# EAGLE design Clockv2 (EAGLE 9.6.2)
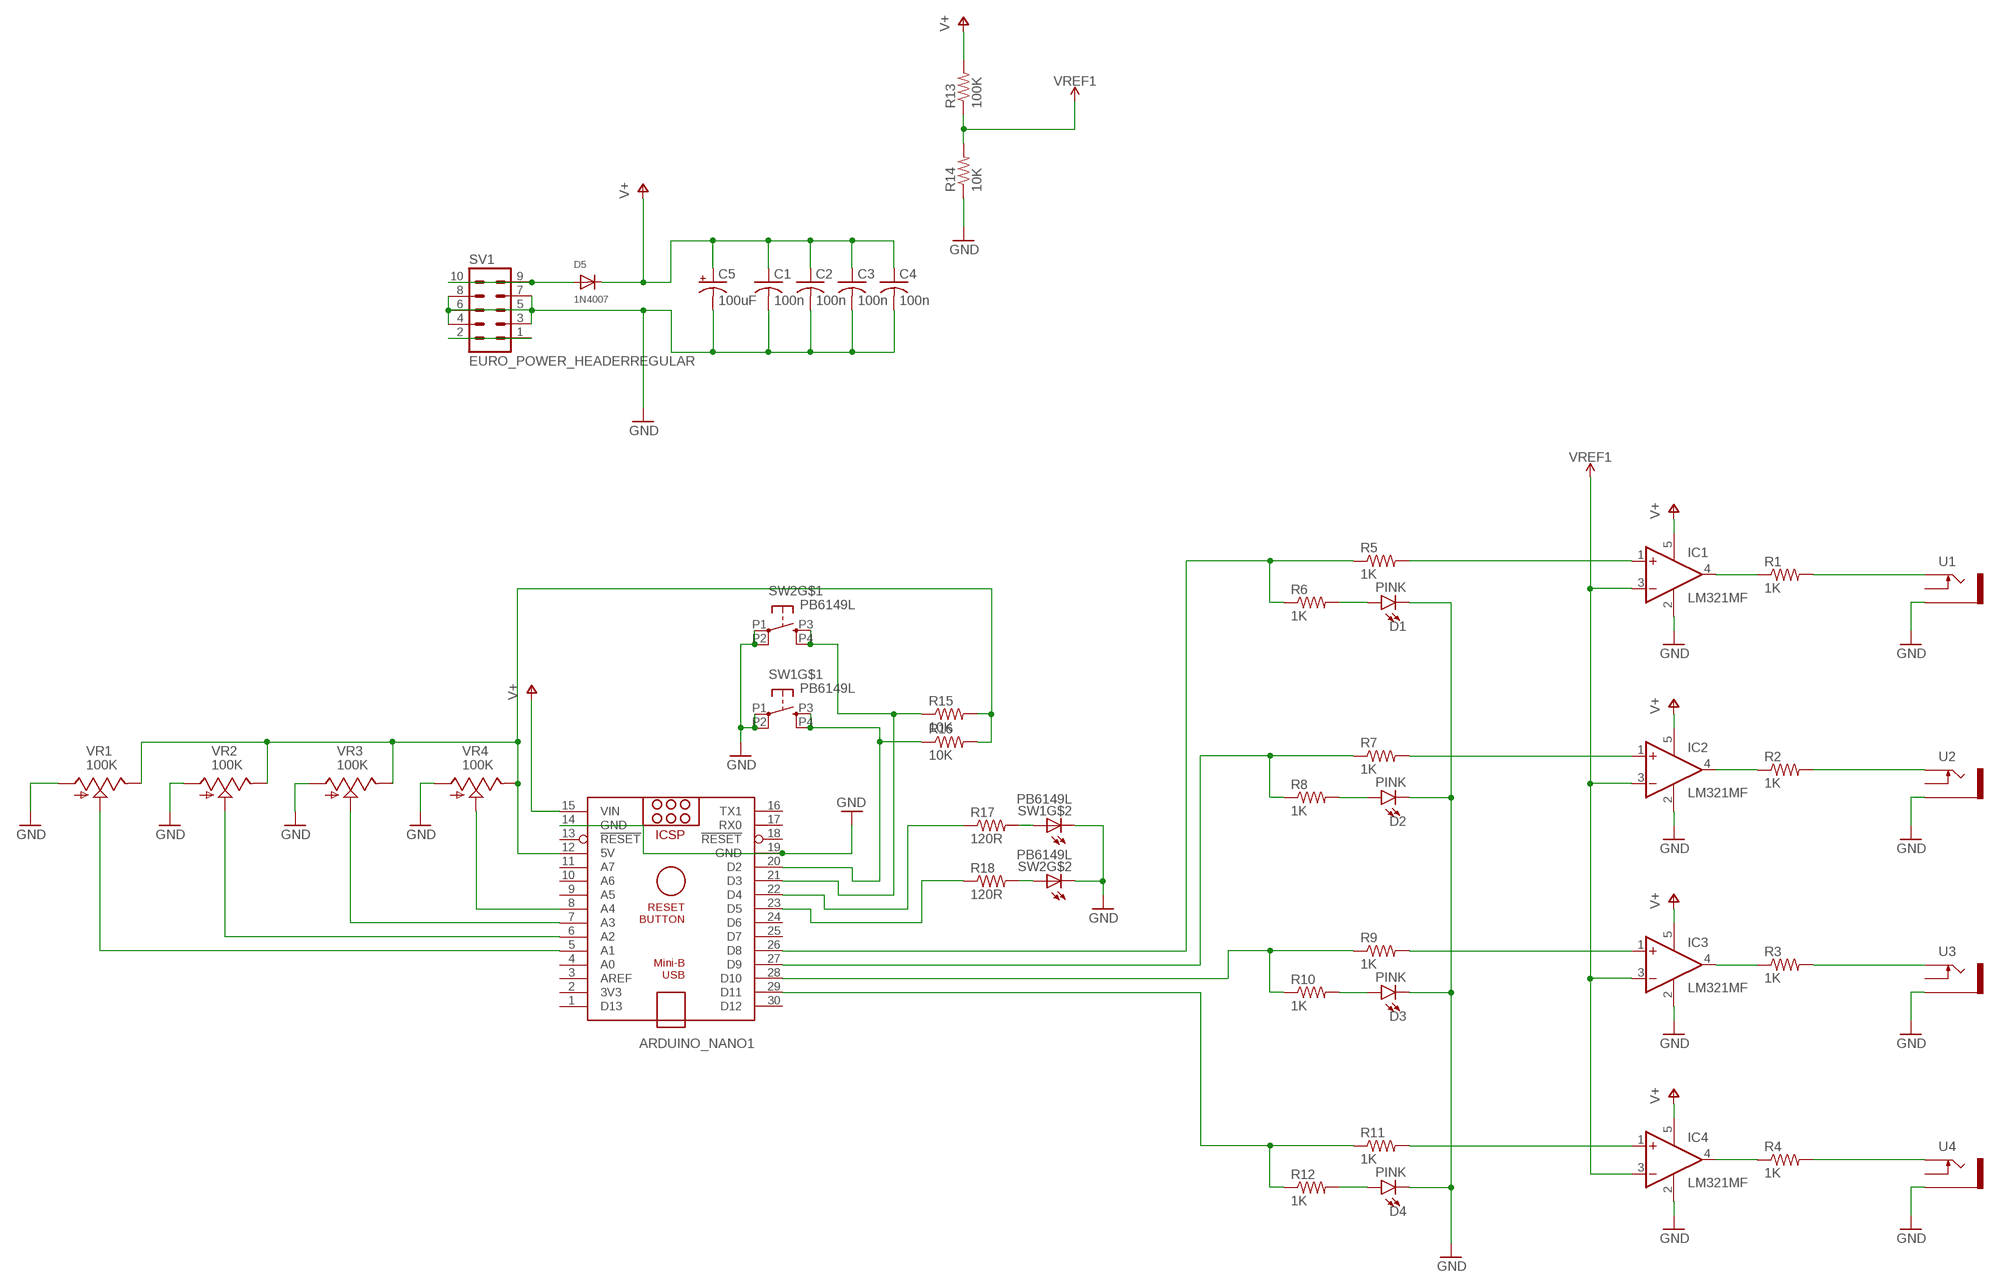
[diagram p0: schematic, sheet 1]

## Parts
ARDUINO_NANO1  ARDUINO_NANO  [ARDUINO_NANO]
C1  100n  C-USC0805K  [C0805K]
C2  100n  C-USC0805K  [C0805K]
C3  100n  C-USC0805K  [C0805K]
C4  100n  C-USC0805K  [C0805K]
C5  100uF  CPOL-USB  [PANASONIC_B]
D1  PINK  LED3MM  [LED_3MM]
D2  PINK  LED3MM  [LED_3MM]
D3  PINK  LED3MM  [LED_3MM]
D4  PINK  LED3MM  [LED_3MM]
D5  1N4007  DIODESOD-123  [SOD-123]
IC1  LM321MF  [SOT23-5]
IC2  LM321MF  [SOT23-5]
IC3  LM321MF  [SOT23-5]
IC4  LM321MF  [SOT23-5]
R1  1K  R-US_R0805  [R0805]
R2  1K  R-US_R0805  [R0805]
R3  1K  R-US_R0805  [R0805]
R4  1K  R-US_R0805  [R0805]
R5  1K  R-US_R0805  [R0805]
R6  1K  R-US_R0805  [R0805]
R7  1K  R-US_R0805  [R0805]
R8  1K  R-US_R0805  [R0805]
R9  1K  R-US_R0805  [R0805]
R10  1K  R-US_R0805  [R0805]
R11  1K  R-US_R0805  [R0805]
R12  1K  R-US_R0805  [R0805]
R13  100K  R-US_R0805  [R0805]
R14  10K  R-US_R0805  [R0805]
R15  10K  R-US_R0805  [R0805]
R16  10K  R-US_R0805  [R0805]
R17  120R  R-US_R0805  [R0805]
R18  120R  R-US_R0805  [R0805]
SV1  EURO_POWER_HEADERREGULAR  [EURO_POWER_HEADER]
SW1  PB6149L  [PB6149L]
SW2  PB6149L  [PB6149L]
U1  THONKICONNNEW  [WQP-PJ301M-12_JACK]
U2  THONKICONNNEW  [WQP-PJ301M-12_JACK]
U3  THONKICONNNEW  [WQP-PJ301M-12_JACK]
U4  THONKICONNNEW  [WQP-PJ301M-12_JACK]
VR1  100K  9MM_SNAP-IN_POT_  [9MM_SNAP-IN_POT]
VR2  100K  9MM_SNAP-IN_POT_  [9MM_SNAP-IN_POT]
VR3  100K  9MM_SNAP-IN_POT_  [9MM_SNAP-IN_POT]
VR4  100K  9MM_SNAP-IN_POT_  [9MM_SNAP-IN_POT]

## Nets
GND: ARDUINO_NANO1.14(GND) ARDUINO_NANO1.19(GND) C1.2 C2.2 C3.2 C4.2 C5.- D1.K(C) D2.K(C) D3.K(C) D4.K(C) IC1.2(V-) IC2.2(V-) IC3.2(V-) IC4.2(V-) R14.1 SV1.3 SV1.4 SV1.5 SV1.6 SV1.7 SV1.8 SW1.L2(C) SW1.P1(P) SW1.P2(P1) SW2.L2(C) SW2.P1(P) SW2.P2(P1) U1.P$3_SLEEVE(SLEEVE) U2.P$3_SLEEVE(SLEEVE) U3.P$3_SLEEVE(SLEEVE) U4.P$3_SLEEVE(SLEEVE) VR1.1(A) VR2.1(A) VR3.1(A) VR4.1(A)
N$1: IC1.4(OUT) R1.1
N$2: IC2.4(OUT) R2.1
N$3: IC3.4(OUT) R3.1
N$4: IC4.4(OUT) R4.1
N$5: R1.2 U1.P$1_TIP(TIP)
N$6: R2.2 U2.P$1_TIP(TIP)
N$7: R3.2 U3.P$1_TIP(TIP)
N$8: R4.2 U4.P$1_TIP(TIP)
N$9: ARDUINO_NANO1.28(D10) R9.1 R10.1
N$10: ARDUINO_NANO1.26(D8) R5.1 R6.1
N$11: ARDUINO_NANO1.27(D9) R7.1 R8.1
N$12: ARDUINO_NANO1.29(D11) R11.1 R12.1
N$13: D1.A R6.2
N$14: ARDUINO_NANO1.12(5V) R15.2 R16.2 VR1.3(E) VR2.3(E) VR3.3(E) VR4.3(E)
N$15: ARDUINO_NANO1.20(D2) R16.1 SW1.P3(S) SW1.P4(S1)
N$16: D2.A R8.2
N$17: ARDUINO_NANO1.21(D3) R15.1 SW2.P3(S) SW2.P4(S1)
N$18: IC2.1(+IN) R7.2
N$19: IC1.1(+IN) R5.2
N$20: IC3.1(+IN) R9.2
N$21: D5.A SV1.9 SV1.10
N$22: D3.A R10.2
N$23: ARDUINO_NANO1.8(A4) VR4.2(S)
N$24: IC4.1(+IN) R11.2
N$25: D4.A R12.2
N$26: ARDUINO_NANO1.7(A3) VR3.2(S)
N$27: ARDUINO_NANO1.6(A2) VR2.2(S)
N$29: ARDUINO_NANO1.5(A1) VR1.2(S)
N$30: R17.2 SW1.L1(A)
N$31: R18.2 SW2.L1(A)
N$32: ARDUINO_NANO1.22(D4) R17.1
N$33: ARDUINO_NANO1.23(D5) R18.1
N$34: SV1.1 SV1.2
V+: ARDUINO_NANO1.15(VIN) C1.1 C2.1 C3.1 C4.1 C5.+ D5.C IC1.5(V+) IC2.5(V+) IC3.5(V+) IC4.5(V+) R13.2
VREF1: IC1.3(-IN) IC2.3(-IN) IC3.3(-IN) IC4.3(-IN) R13.1 R14.2
Unconnected: ARDUINO_NANO1.1(D13) ARDUINO_NANO1.2(3V3) ARDUINO_NANO1.3(AREF) ARDUINO_NANO1.4(A0) ARDUINO_NANO1.9(A5) ARDUINO_NANO1.10(A6) ARDUINO_NANO1.11(A7) ARDUINO_NANO1.13(!RESET) ARDUINO_NANO1.16(TX1) ARDUINO_NANO1.17(RX0) ARDUINO_NANO1.18(!RESET) ARDUINO_NANO1.24(D6) ARDUINO_NANO1.25(D7) ARDUINO_NANO1.30(D12) U1.P$2_SWITCH(SWITCH) U2.P$2_SWITCH(SWITCH) U3.P$2_SWITCH(SWITCH) U4.P$2_SWITCH(SWITCH)

## Library data of the parts
ARDUINO_NANO1 = ArduinoNanoV30:ARDUINO_NANO: Arduino Nano V3.0 Overview: The Arduino Nano is a small, complete, and breadboard-friendly board based on the ATmega328 (Arduino Nano 3.x) or ATmega168 (Arduino Nano 2.x). It has more or less the same functionality of the Arduino Duemilanove, but in a different package. It lacks only a DC power jack, and works with a Mini-B USB cable instead of a standard one. The Nano was designed and is being produced by Gravitech. Specifications: Microcontroller Atmel ATmega168 or ATmega328 Operating Voltage (logic level) 5 V Input Voltage (recommended) 7-12 V Input Voltage (limits) 6-20 V Digital I/O Pins 14 (of which 6 provide PWM output) Analog Input Pins 8 DC Current per I/O Pin 40 mA Flash Memory 16 KB (ATmega168) or 32 KB (ATmega328) of which 2 KB used by bootloader SRAM 1 KB (ATmega168) or 2 KB (ATmega328) EEPROM 512 bytes (ATmega168) or 1 KB (ATmega328) Clock Speed 16 MHz Dimensions 0.73" x 1.70" Length 45 mm Width 18 mm Weigth 5 g Power: The Arduino Nano can be powered via the Mini-B USB connection, 6-20V unregulated external power supply (pin 30), or 5V regulated external power supply (pin 27). The power source is automatically selected to the highest voltage source. Memory: The ATmega168 has 16 KB of flash memory for storing code (of which 2 KB is used for the bootloader); the ATmega328 has 32 KB, (also with 2 KB used for the bootloader). The ATmega168 has 1 KB of SRAM and 512 bytes of EEPROM (which can be read and written with the EEPROM library); the ATmega328 has 2 KB of SRAM and 1 KB of EEPROM. Input and Output: Each of the 14 digital pins on the Nano can be used as an input or output, using pinMode(), digitalWrite(), and digitalRead() functions. They operate at 5 volts. Each pin can provide or receive a maximum of 40 mA and has an internal pull-up resistor (disconnected by default) of 20-50 kOhms. In addition, some pins have specialized functions. Visit Arduino - ArduinoBoardNano <https://www.arduino.cc/en/Main/ArduinoBoardNano>
C1-C4 = adafruit:C-US: CAPACITOR, American symbol
C5 = adafruit:CPOL-US: POLARIZED CAPACITOR, American symbol
D1-D4 = SparkFun-LED:LED: LED (Generic) Standard schematic elements and footprints for 5mm, 3mm, 1206, and 0603 sized LEDs. Generic LEDs with no color specified.; PROD_ID: DIO-08794
D5 = adafruit:DIODE: Diode SMADIODE - SMA Surface Mount Package 20V 1A Schottky Diode Digikey: 641-1014-6-ND DO-1N4148 - Through Hole Small Current Diode SOD-123 20V 1 A (.5mV Vf) Schottky Diode - Digikey: MBRX120TPMSCT-ND SOD-323 10V 570mA (.38mV Vf, 3ns) Schottky Diode - Digikey: ZLLS410CT-ND SOD-523 30V 30mA Schottky Diode (RB751S-40TE61) - Digikey: RB751S-40TE61CT-ND SOT23-R/W - SOT23 Package (R = Solder Paste/Reflow Ovens, W = Hand-Soldering) BAT54Film 40V 300mA - Digikey: 497-7162-1-ND
IC1-IC4 = linear:LM321?*: Low Power Single Op Amp Source: http://cache.national.com/ds/LM/LM321.pdf
R1-R18 = adafruit:R-US_: RESISTOR, American symbol
SV1 = MusicThingModular:EURO_POWER_HEADER: Power Header 10 pin power header for Eurorack Power Supplies Variants with fatter pads for easier soldering, and the LOCK variant which has 5mil offset pins to hold the component in place before soldering
SW1 SW2 = nightcapaudio:PB6149L: PB6149L Illuminated Tactile Switch
U1-U4 = MusicThingModular:THONKICONN: 3.5mm socket for Eurorack modular synths
VR1-VR4 = MusicThingModular:9MM_SNAP-IN_POT: 9mm vertical snap-in pot, Alpha / Panasonic style

## Board
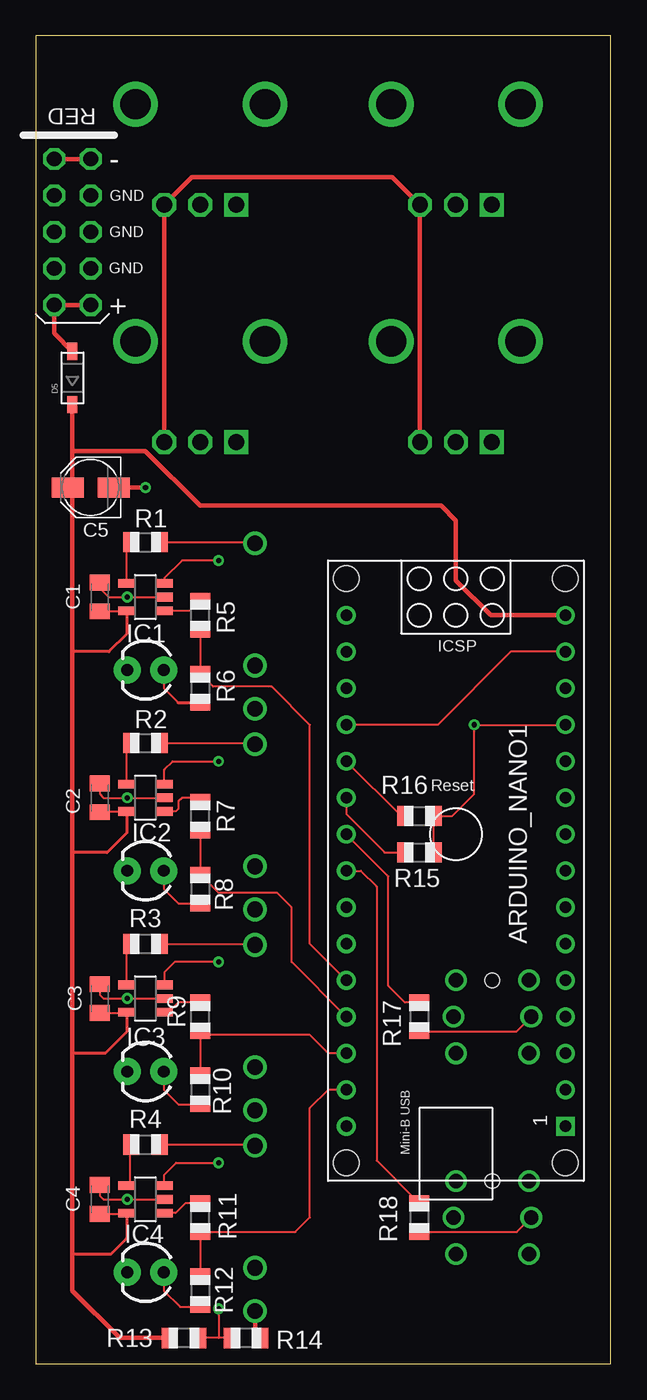
[diagram p1: board, top side]
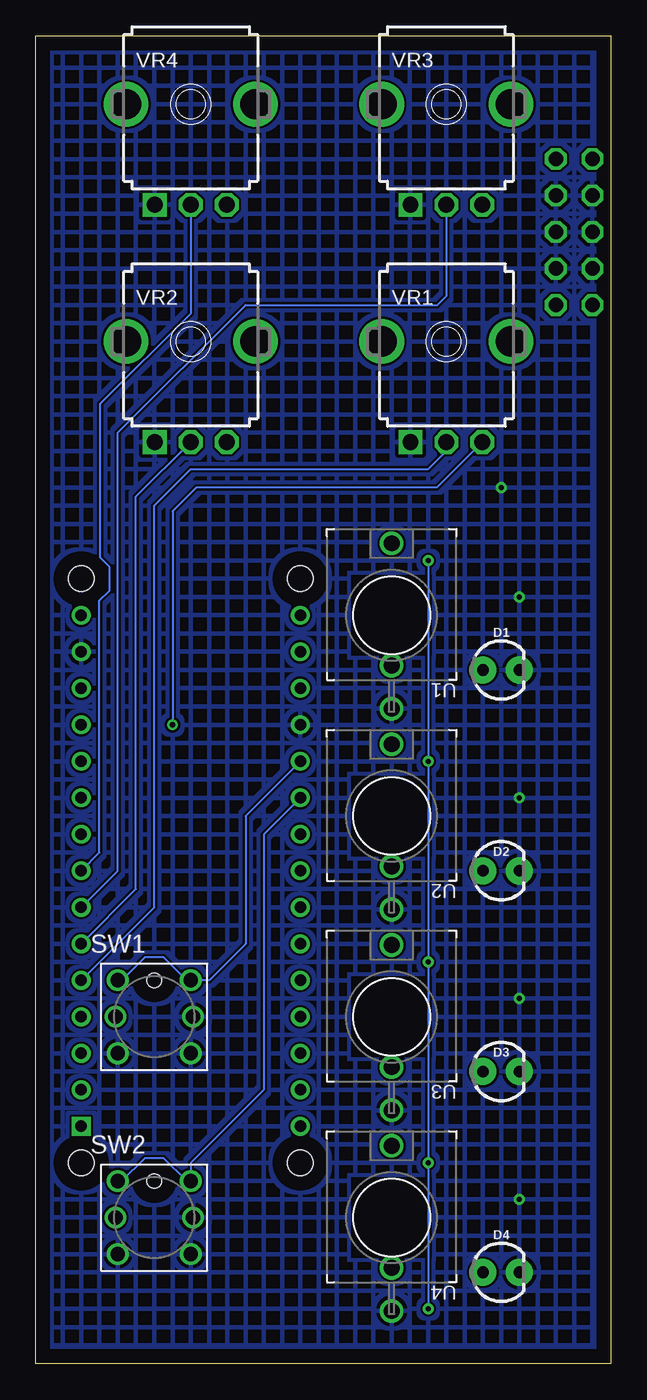
[diagram p2: board, bottom side, seen from below]

Size 39.98 x 92.38 mm. Coordinates in mm from the lower left corner, seen from the top.
Outline: 0,92.38 0,0 39.98,0 39.98,92.38 0,92.38
Copper layers (1*16): Top 0.035mm / dielectric 1.5mm / Bottom 0.035mm
Design rules "default": minimum track width 6mil, minimum drill 0.35mm, track to track 6mil, track to pad 6mil, pad to pad 6mil, via to via 6mil, smd to smd 6mil, copper to edge 40mil, drill to drill 6mil, minimum pad ring 10mil, minimum via ring 8mil, stop-mask expansion 4mil, vias tented up to drill 0mil, thermal gap 10mil

### Footprints (pad centres in the part's own frame; a part is rotated, then mirrored left to right if it is on the bottom)
ARDUINO_NANO = drill 0.8 square: 1 -20.32,-7.62 | drill 0.8: 2 -17.78,-7.62; 3 -15.24,-7.62; 4 -12.7,-7.62; 5 -10.16,-7.62; 6 -7.62,-7.62; 7 -5.08,-7.62; 8 -2.54,-7.62; 9 0,-7.62; 10 2.54,-7.62; 11 5.08,-7.62; 12 7.62,-7.62; 13 10.16,-7.62; 14 12.7,-7.62; 15 15.24,-7.62; 16 15.24,7.62; 17 12.7,7.62; 18 10.16,7.62; 19 7.62,7.62; 20 5.08,7.62; 21 2.54,7.62; 22 0,7.62; 23 -2.54,7.62; 24 -5.08,7.62; 25 -7.62,7.62; 26 -10.16,7.62; 27 -12.7,7.62; 28 -15.24,7.62; 29 -17.78,7.62; 30 -20.32,7.62 | hole 1.778: -22.86,-7.62; -22.86,7.62; 17.78,7.62; 17.78,-7.62
C0805K = smd 1.1 x 1.4: 1 -1,0; 2 1,0
PANASONIC_B = smd 2.2 x 1.4: + 1.6,0; - -1.6,0
LED_3MM = drill 0.813 pad 1.88: A -1.27,0; K 1.27,0
SOD-123 = smd 1.2 x 0.7: A 1.85,0; C -1.85,0
SOT23-5 = smd 0.6 x 1.2: 1 -0.95,-1.306; 2 0,-1.306; 3 0.95,-1.306; 4 0.95,1.306; 5 -0.95,1.306
R0805 = smd 1.1 x 1.4: 1 -1,0; 2 1,0
EURO_POWER_HEADER = drill 1.016 octagon: 1 -5.08,-1.27; 2 -5.08,1.27; 3 -2.54,-1.27; 4 -2.54,1.27; 5 0,-1.27; 6 0,1.27; 7 2.54,-1.27; 8 2.54,1.27; 9 5.08,-1.27; 10 5.08,1.27
PB6149L = drill 1: L1 -2.7,0; L2 2.7,0; P1 -2.54,-2.54; P2 2.54,-2.54; P3 -2.54,2.54; P4 2.54,2.54 | hole 1: 0,2.54
WQP-PJ301M-12_JACK = drill 1.1: P$1_TIP 0,5; P$2_SWITCH 0,-3.5; P$3_SLEEVE 0,-6.5
9MM_SNAP-IN_POT = drill 1.1 square: 1 -2.5,-7 | drill 1.1 octagon: 2 0,-7; 3 2.5,-7 | drill 2.1 pad 2.794: CHASSIS1 -4.5,0; CHASSIS2 4.5,0

### Placement (x,y rotation side)
ARDUINO_NANO1  29.21,36.83 90 top
C1  4.45,53.34 90 top
C2  4.45,39.37 90 top
C3  4.45,25.4 90 top
C4  4.45,11.43 90 top
C5  3.81,60.96 180 top
D1  7.62,48.26 0 bottom
D2  7.62,34.29 0 bottom
D3  7.62,20.32 0 bottom
D4  7.62,6.35 0 bottom
D5  2.54,68.58 90 top
IC1  7.62,53.34 90 top
IC2  7.62,39.37 90 top
IC3  7.62,25.4 90 top
IC4  7.62,11.43 90 top
R1  7.62,57.15 0 top
R2  7.62,43.18 0 top
R3  7.62,29.21 0 top
R4  7.62,15.24 0 top
R5  11.43,52.07 90 top
R6  11.43,46.99 270 top
R7  11.43,38.1 90 top
R8  11.43,33.02 270 top
R9  11.43,24.13 90 top
R10  11.43,19.05 270 top
R11  11.43,10.16 90 top
R12  11.43,5.08 270 top
R13  10.29,1.78 180 top
R14  14.61,1.78 180 top
R15  26.67,35.56 0 top
R16  26.67,38.1 0 top
R17  26.67,24.13 270 top
R18  26.67,10.16 270 top
SV1  2.54,78.74 270 top
SW1  31.75,24.13 0 bottom
SW2  31.75,10.16 0 bottom
U1  15.24,52.07 0 bottom
U2  15.24,38.1 0 bottom
U3  15.24,24.13 0 bottom
U4  15.24,10.16 0 bottom
VR1  11.43,71.12 0 bottom
VR2  29.21,71.12 0 bottom
VR3  11.43,87.63 0 bottom
VR4  29.21,87.63 0 bottom

### Tracks (layer width: path | path; a pad name or v marks a point on that pad's centre or on a via)
GND  (via drill 0.35)
  Top 0.152: C1.2 4.45,53.98 5.08,53.34 v6.35,53.34 IC1.2 | C2.2 4.45,39.62 4.7,39.37 v6.35,39.37 IC2.2 | C3.2 4.45,25.65 4.7,25.4 v6.35,25.4 IC3.2 | C4.2 4.45,11.68 4.7,11.43 v6.35,11.43 IC4.2 | 5.08,60.96 C5.- | 15.24,2.22 15.56,1.91 R14.1 | ARDUINO_NANO1.19 27.94,44.45 33.02,49.53 ARDUINO_NANO1.14
  Top 0.305: C5.- v7.62,60.96 | R14.1 15.24,2.14 U4.P$3_SLEEVE
  pour Bottom (hatched): 0,0 0,92.71 40.64,92.71 40.64,0
N$1
  Top 0.152: IC1.4 6.31,56.84 R1.1
N$2
  Top 0.152: IC2.4 6.31,42.87 R2.1
N$3
  Top 0.152: IC3.4 6.31,28.9 R3.1
N$4
  Top 0.152: IC4.4 6.35,12.38 6.51,12.54 6.51,15.24 R4.1
N$5
  Top 0.152: R1.2 15.16,57.15 U1.P$1_TIP
N$6
  Top 0.152: R2.2 15.16,43.18 U2.P$1_TIP
N$7
  Top 0.152: R3.2 15.16,29.21 U3.P$1_TIP
N$8
  Top 0.152: R4.2 15.16,15.24 U4.P$1_TIP
N$9
  Top 0.152: R9.1 11.43,22.86 | 11.43,22.86 R10.1 | ARDUINO_NANO1.28 20.32,21.59 19.05,22.86 11.43,22.86
N$10
  Top 0.152: ARDUINO_NANO1.26 19.05,29.21 19.05,44.45 16.4,47.1 12.32,47.1 R6.1 R5.1
N$11
  Top 0.152: ARDUINO_NANO1.27 17.78,27.94 17.78,31.75 16.78,32.75 12.7,32.75 R8.1 R7.1
N$12
  Top 0.152: ARDUINO_NANO1.29 20.32,19.05 19.05,17.78 19.05,10.16 18.05,9.16 R11.1 R12.1
N$13
  Top 0.152: D1.A 8.89,46.99 9.89,45.99
  Top 0.2: 9.89,45.99 R6.2
N$14  (via drill 0.35)
  Top 0.152: 26.71,64.77 VR2.3 | ARDUINO_NANO1.12 v30.48,44.45 30.48,39.64 28.94,38.1 R16.2 R15.2
  Top 0.305: 26.71,64.77 VR4.3 24.79,82.55 10.85,82.55 VR3.3 VR1.3
  Bottom 0.152: VR1.3 12.09,60.96 28.83,60.96 30.48,59.31 v30.48,44.45
N$15
  Top 0.152: ARDUINO_NANO1.20 25.4,38.1 R16.1
  Bottom 0.152: ARDUINO_NANO1.20 25.4,38.1 25.4,29.21 27.94,26.67 SW1.P4 29.5,26.67 31.09,28.26 32.41,28.26 34,26.67 SW1.P3
N$16
  Top 0.152: D2.A 8.89,33.02 9.89,32.02 R8.2
N$17
  Top 0.152: ARDUINO_NANO1.21 21.59,38.23 24.26,35.56 R15.1
  Bottom 0.152: ARDUINO_NANO1.21 24.13,36.83 24.13,19.05 29.21,13.97 SW2.P4 29.5,12.7 31.09,14.29 32.41,14.29 34,12.7 SW2.P3
N$18
  Top 0.152: R7.2 11.16,39.37 10.16,39.37 9.91,39.12 9.91,38.61 9.72,38.42 IC2.1
N$19
  Top 0.152: IC1.1 10.75,52.39 R5.2
N$20
  Top 0.152: R9.2 9.89,25.13 9.21,24.45 IC3.1
N$21
  Top 0.305: D5.A 1.27,71.7 SV1.9 SV1.10
N$22
  Top 0.152: D3.A 8.89,19.05 9.89,18.05 R10.2
N$23
  Bottom 0.152: ARDUINO_NANO1.8 35.56,35.56 35.56,53.08 34.85,53.79 34.85,55.43 35.5,56.08 35.5,66.78 29.21,73.07 VR4.2
N$24
  Top 0.152: R11.2 10.4,11.16 9.72,10.48 IC4.1
N$25
  Top 0.152: R12.2 11.29,3.94 10.03,3.94 8.89,5.08 D4.A
N$26
  Bottom 0.152: ARDUINO_NANO1.7 34.29,34.29 34.29,64.77 25.4,73.66 12.05,73.66 11.43,74.28 VR3.2
N$27
  Bottom 0.152: ARDUINO_NANO1.6 33.02,33.02 33.02,60.31 VR2.2
N$29
  Bottom 0.152: ARDUINO_NANO1.5 31.75,31.75 31.75,59.69 29.21,62.23 12.7,62.23 11.43,63.5 VR1.2
N$30
  Top 0.152: SW1.L1 33.45,23.13 R17.2
N$31
  Top 0.152: R18.2 33.45,9.16 SW2.L1
N$32
  Top 0.152: R17.1 25.67,25.13 24.51,26.29 24.51,33.91 ARDUINO_NANO1.22
N$33
  Top 0.152: R18.1 23.7,14.13 23.7,33.2 22.61,34.29 ARDUINO_NANO1.23
N$34
  Top 0.305: SV1.1 SV1.2
V+
  Top 0.152: IC2.5 6.26,38.37 C2.1 | C3.1 6.26,24.4 IC3.5 | IC1.5 6.26,52.34 C1.1 | C4.1 6.26,10.43 IC4.5 | 2.38,60.8 C5.+ 2.54,60.96
  Top 0.203: IC4.5 6.31,8.73 5.21,7.62 2.54,7.62 | IC3.5 6.31,23.08 4.83,21.59 2.54,21.59 | IC2.5 6.31,36.92 4.95,35.56 2.54,35.56 | IC1.5 6.31,50.76 5.08,49.53 2.54,49.53
  Top 0.305: ARDUINO_NANO1.15 31.62,52.07 29.21,54.48 29.21,58.67 28.19,59.69 11.43,59.69 7.62,63.5 2.54,63.5 | R13.2 5.84,1.78 2.54,5.08 2.54,7.62 2.54,21.59 2.54,35.56 2.54,49.53 2.54,60.63 2.38,60.8 | D5.C 2.54,63.5 | 2.54,60.96 2.54,63.5
VREF1  (via drill 0.35)
  Top 0.152: v12.7,55.88 10.16,55.88 8.93,54.65 IC1.3 | IC2.3 8.93,41.34 9.5,41.91 v12.7,41.91 | v12.7,27.94 9.65,27.94 8.93,27.21 IC3.3 | IC4.3 8.93,13.14 9.75,13.97 v12.7,13.97 | R14.2 12.7,1.78 | 12.7,1.78 R13.1 | v12.7,3.81 12.7,1.78
  Bottom 0.152: v12.7,55.88 v12.7,41.91 v12.7,27.94 v12.7,13.97 v12.7,3.81